# Altium schematic sheet ZBuff-Interpolate Stage Diagram.SchDoc
size A; Engineer: Alejandro Argueta; DocumentName: Z-Buffer/Interpolator Stage; ProjectName: gUpGPU
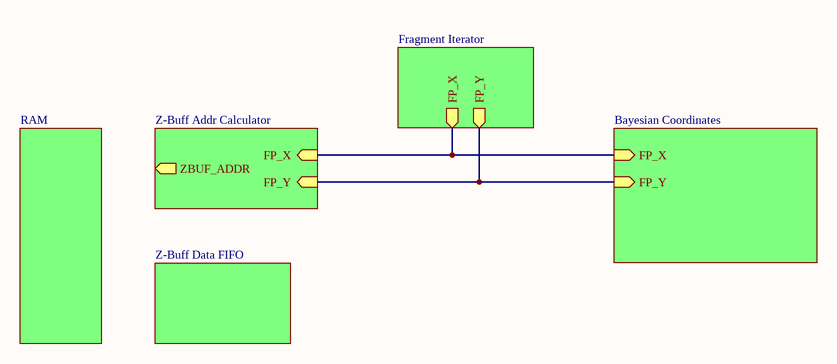
[diagram p0: ZBuff-Interpolate Stage Diagram.SchDoc]

## Sub-sheets
? = Fragment Iterator: FP_X (out), FP_Y (out)
? = Z-Buff Addr Calculator: FP_X (in), FP_Y (in), ZBUF_ADDR (out)
? = Z-Buff Data FIFO: no entries
? = RAM: no entries
? = Bayesian Coordinates: FP_X (in), FP_Y (in)

## Nets
(unnamed): sheet /FP_X, sheet /FP_X, sheet /FP_X
(unnamed): sheet /FP_Y, sheet /FP_Y, sheet /FP_Y